# EAGLE schematic mic (EAGLE 6.1)

## Sheet 1 of 3
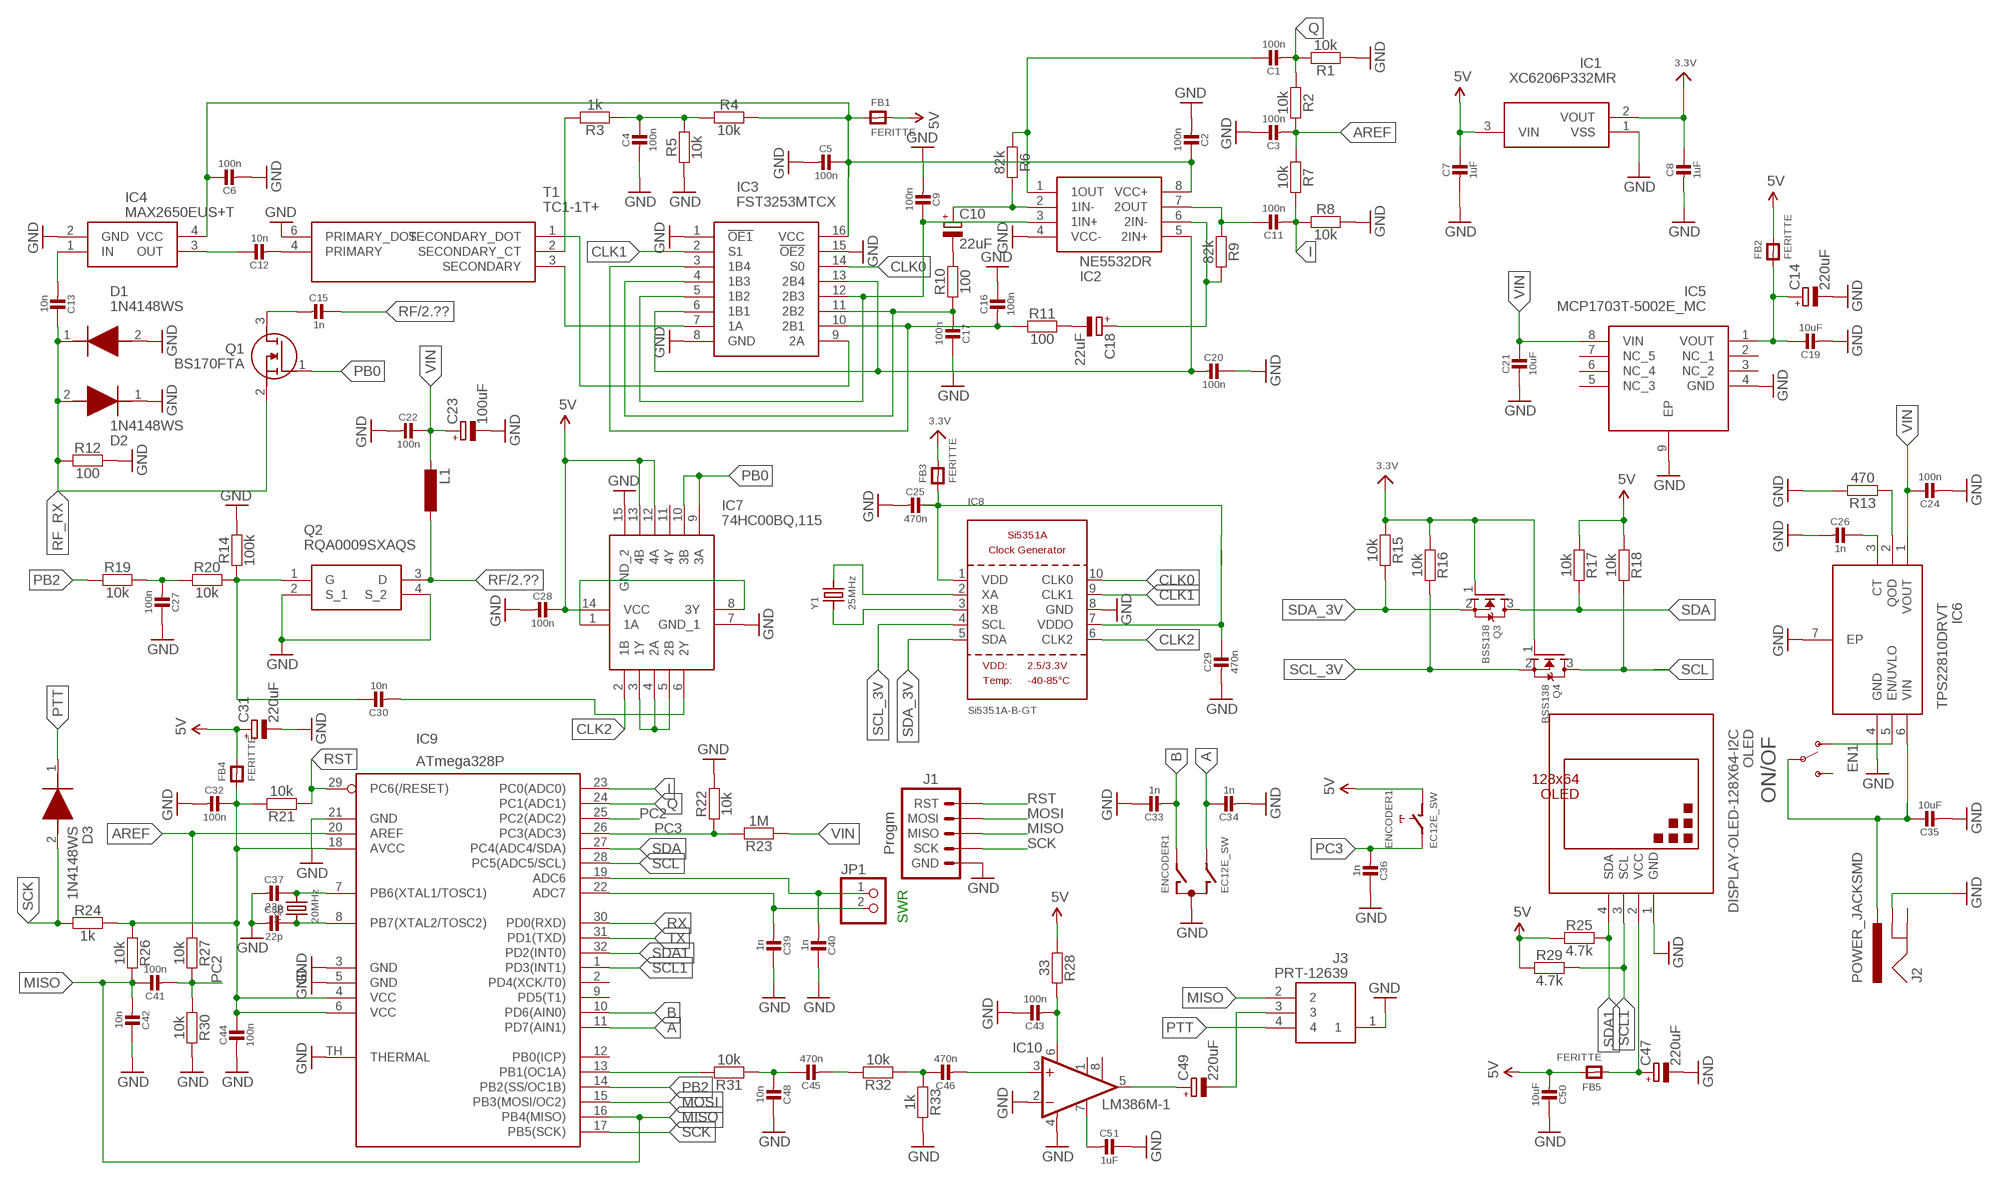
[diagram p0: schematic, sheet 1]

### Parts
C1  100n  CAP_CERAMIC_0402  [_0402]
C2  100n  CAP_CERAMIC_0402  [_0402]
C3  100n  CAP_CERAMIC_0402  [_0402]
C4  100n  CAP_CERAMIC_0402  [_0402]
C5  100n  CAP_CERAMIC_0402  [_0402]
C6  100n  CAP_CERAMIC_0402  [_0402]
C7  1uF  CAP_CERAMIC_0603  [_0603]
C8  1uF  CAP_CERAMIC_0603  [_0603]
C9  100n  CAP_CERAMIC_0402  [_0402]
C10  22uF  CPOL-EUSMCA  [SMC_A]
C11  100n  CAP_CERAMIC_0402  [_0402]
C12  10n  CAP_CERAMIC_0402  [_0402]
C13  10n  CAP_CERAMIC_0402  [_0402]
C14  220uF  CPOL-EUSANYO_A  [SANYO-OSCON_A]
C15  1n  CAP_CERAMIC_0603  [_0603]
C16  100n  CAP_CERAMIC_0402  [_0402]
C17  100n  CAP_CERAMIC_0402  [_0402]
C18  22uF  CPOL-EUSMCA  [SMC_A]
C19  10uF  CAP_CERAMIC_0402  [_0402]
C20  100n  CAP_CERAMIC_0402  [_0402]
C21  10uF  CAP_CERAMIC_0402  [_0402]
C22  100n  CAP_CERAMIC_0402  [_0402]
C23  100uF  CPOL-EUSMCD  [SMC_D]
C24  100n  CAP_CERAMIC_0805  [_0805]
C25  470n  CAP_CERAMIC_0402  [_0402]
C26  1n  CAP_CERAMIC_0402  [_0402]
C27  100n  CAP_CERAMIC_0402  [_0402]
C28  100n  CAP_CERAMIC_0402  [_0402]
C29  470n  CAP_CERAMIC_0402  [_0402]
C30  10n  CAP_CERAMIC_0402  [_0402]
C31  220uF  CPOL-EUSANYO_A  [SANYO-OSCON_A]
C32  100n  CAP_CERAMIC_0402  [_0402]
C33  1n  CAP_CERAMIC_0402  [_0402]
C34  1n  CAP_CERAMIC_0402  [_0402]
C35  10uF  CAP_CERAMIC_0805  [_0805]
C36  1n  CAP_CERAMIC_0402  [_0402]
C37  22p  CAP_CERAMIC_0402  [_0402]
C38  22p  CAP_CERAMIC_0402  [_0402]
C39  1n  CAP_CERAMIC_0402  [_0402]
C40  1n  CAP_CERAMIC_0402  [_0402]
C41  100n  CAP_CERAMIC_0402  [_0402]
C42  10n  CAP_CERAMIC_0402  [_0402]
C43  100n  CAP_CERAMIC_0402  [_0402]
C44  100n  CAP_CERAMIC_0402  [_0402]
C45  470n  CAP_CERAMIC_0402  [_0402]
C46  470n  CAP_CERAMIC_0402  [_0402]
C47  220uF  CPOL-EUSANYO_A  [SANYO-OSCON_A]
C48  10n  CAP_CERAMIC_0402  [_0402]
C49  220uF  CPOL-EUSANYO_A  [SANYO-OSCON_A]
C50  10uF  CAP_CERAMIC_0402  [_0402]
C51  1uF  CAP_CERAMIC_0402  [_0402]
D1  1N4148WS  [SODFL2512X90N]
D2  1N4148WS  [SODFL2512X90N]
D3  1N4148WS  [SODFL2512X90N]
ENCODER1  EC12E_SW  [ALPS_EC12E_SW]
FB1  FERITTE  FERRITE_0603  [_0603]
FB2  FERITTE  FERRITE_0603  [_0603]
FB3  FERITTE  FERRITE_0603  [_0603]
FB4  FERITTE  FERRITE_0603  [_0603]
FB5  FERITTE  FERRITE_0603  [_0603]
IC1  XC6206P332MR  [SOT95P280X130-3N]
IC2  NE5532DR  [SOIC127P600X175-8N]
IC3  FST3253MTCX  [SOP65P640X110-16N]
IC4  MAX2650EUS+T  [4-SOT143]
IC5  MCP1703T-5002E_MC  [SON50P300X200X100-9N]
IC6  TPS22810DRVT  [SON65P200X200X80-7N]
IC7  74HC00BQ,115  [74HC00BQ115]
IC8  Si5351A-B-GT  SI5351A  [MSOP10]
IC9  ATmega328P  MEGA8-MI  [MLF32-TH]
IC10  LM386M-1  [SO08]
J1  Progm  SPARKFUN-CONNECTORS_PIC-ICSP-MINI  [SPARKFUN-CONNECTORS_PIC-ICSP-MINI]
J2  POWER_JACKSMD  [POWER_JACK_SMD]
J3  PRT-12639  [PRT12639]
JP1  PINHD-1X2  [1X02]
L1  RCL_L-EUTFI0305  [RCL_TFI0305]
OLED  DISPLAY-OLED-128X64-I2C  NEW_DIY-MODULES_(1)_DISPLAY-OLED-128X64-I2C  [NEW_DIY-MODULES_(1)_DISPLAY-OLED-128X64-I2C]
ON/OF  SWITCH-SPDT-SMD-RIGHT-ANGLE  [SWITCH_SPST_SMD_A]
Q1  BS170FTA  [SOT96P240X100-3N]
Q2  RQA0009SXAQS  [RQA0009SXAQS]
Q3  BSS138  MOSFET-NWIDE  [SOT23-WIDE]
Q4  BSS138  MOSFET-NWIDE  [SOT23-WIDE]
R1  10k  RESISTORS-0402  [C0402]
R2  10k  RESISTORS-0402  [C0402]
R3  1k  RESISTORS-0402  [C0402]
R4  10k  RESISTORS-0402  [C0402]
R5  10k  RESISTORS-0402  [C0402]
R6  82k  RESISTORS-0402  [C0402]
R7  10k  RESISTORS-0402  [C0402]
R8  10k  RESISTORS-0402  [C0402]
R9  82k  RESISTORS-0402  [C0402]
R10  100  RESISTORS-0402  [C0402]
R11  100  RESISTORS-0402  [C0402]
R12  100  RESISTORS-0603  [C0603]
R13  470  RESISTORS-0402  [C0402]
R14  100k  RESISTORS-0402  [C0402]
R15  10k  RESISTORS-0402  [C0402]
R16  10k  RESISTORS-0402  [C0402]
R17  10k  RESISTORS-0402  [C0402]
R18  10k  RESISTORS-0402  [C0402]
R19  10k  RESISTORS-0402  [C0402]
R20  10k  RESISTORS-0402  [C0402]
R21  10k  RESISTORS-0402  [C0402]
R22  10k  RESISTORS-0402  [C0402]
R23  1M  RESISTORS-0402  [C0402]
R24  1k  RESISTORS-0402  [C0402]
R25  4.7k  RESISTORS-0402  [C0402]
R26  10k  RESISTORS-0402  [C0402]
R27  10k  RESISTORS-0402  [C0402]
R28  33  RESISTORS-0805  [C0805]
R29  4.7k  RESISTORS-0402  [C0402]
R30  10k  RESISTORS-0402  [C0402]
R31  10k  RESISTORS-0402  [C0402]
R32  10k  RESISTORS-0402  [C0402]
R33  1k  RESISTORS-0402  [C0402]
T1  TC1-1T+  [TC11T]
Y1  25MHz  CRYSTAL3.2X2.5  [CRYSTAL_3.2X2.5]
Y2  20MHz  CRYSTAL3.2X2.5  [CRYSTAL_3.2X2.5]

### Nets
5V: C7.1 C28.1 C31.+ C50.2 ENCODER1.D FB1.2 FB2.2 FB4.2 FB5.2 IC1.3(VIN) IC7.12(4A) IC7.13(4B) IC7.14(VCC) R17.2 R18.2 R25.2 R28.2 R29.2 ; also sheet 2
A: C34.1 ENCODER1.B IC9.11(PD7(AIN1))
AREF: C3.2 IC9.20(AREF) R2.1 R7.2 R27.2
B: C33.2 ENCODER1.A IC9.10(PD6(AIN0))
CLK0: IC3.14(S0) IC8.10(CLK0)
CLK1: IC3.2(S1) IC8.9(CLK1)
CLK2: IC7.2(1B) IC8.6(CLK2)
EN1: IC6.5(EN/UVLO) ON/OF.1(O)
GND: C2.2 C3.1 C4.2 C5.2 C6.2 C7.2 C8.2 C9.2 C14.- C16.1 C17.1 C19.2 C20.1 C21.2 C22.2 C23.- C24.2 C25.2 C26.2 C27.1 C28.2 C29.2 C31.- C32.2 C33.1 C34.2 C35.2 C36.1 C37.2 C38.2 C39.1 C40.1 C42.1 C43.1 C44.2 C47.- C48.1 C50.1 C51.1 D1.2(A) D2.1(K) ENCODER1.C IC1.1(VSS) IC2.4(VCC-) IC3.1(!OE1) IC3.8(GND) IC3.15(!OE2) IC4.2(GND) IC5.4(GND) IC5.9(EP) IC6.4(GND) IC6.7(EP) IC7.7(GND_1) IC7.15(GND_2) IC8.8(GND) IC9.3(GND) IC9.5(GND) IC9.21(GND) IC9.TH(THERMAL) IC10.2(-IN) IC10.4(GND) J1.5(GND) J2.GND(GNDBREAK) J3.1 OLED.1(GND) Q2.2(S_1) Q2.4(S_2) R1.2 R5.2 R8.1 R12.1 R13.2 R14.1 R22.1 R30.1 R33.1 T1.6(PRIMARY_DOT) ; also sheet 2,3
I: C11.2 IC9.23(PC0(ADC0)) R7.1 R8.2
MISO: C41.1 C42.2 IC9.16(PB4(MISO)) J1.3(MISO) J3.2 R26.1
MOSI: IC9.15(PB3(MOSI/OC2)) J1.2(MOSI)
N$1: IC7.3(1Y) IC7.4(2A) IC7.5(2B)
N$6: IC3.7(1A) T1.3(SECONDARY)
N$12: C47.+ FB5.1 OLED.2(VCC)
N$13: C37.1 IC9.7(PB6(XTAL1/TOSC1)) Y2.2
N$14: C38.1 IC9.8(PB7(XTAL2/TOSC2)) Y2.1
N$16: IC3.9(2A) T1.1(SECONDARY_DOT)
N$22: C4.1 R3.2 R4.2 R5.1
N$23: IC7.1(1A) IC7.8(3Y)
N$24: C30.2 IC7.6(2Y)
N$25: C30.1 Q2.1(G) R14.2 R20.1
N$26: C27.2 R19.1 R20.2
N$27: C26.1 IC6.3(CT)
N$28: C20.2 IC2.5(2IN+) IC3.6(1B1) IC3.13(2B4)
N$29: C9.1 IC2.3(1IN+) IC3.5(1B2) IC3.12(2B3)
N$30: R3.1 T1.2(SECONDARY_CT)
N$31: C17.2 IC3.4(1B3) IC3.11(2B2) R10.2
N$32: C16.2 IC3.3(1B4) IC3.10(2B1) R11.2
N$33: C1.1 IC2.1(1OUT) R6.2
N$34: IC9.13(PB1(OC1A)) R31.1
N$35: C45.1 C48.2 R31.2
N$36: C11.1 IC2.7(2OUT) R9.2
N$37: C18.- R11.1
N$38: C18.+ IC2.6(2IN-) R9.1
N$39: C10.+ IC2.2(1IN-) R6.1
N$40: C10.- R10.1
N$41: C45.2 R32.1
N$43: C46.1 R32.2 R33.2
N$44: C32.1 C44.1 FB4.1 IC9.4(VCC) IC9.6(VCC) IC9.18(AVCC) R21.1 R24.1 R26.2
N$45: C46.2 IC10.3(+IN)
N$46: C43.2 IC10.6(VS) R28.1
N$47: C51.2 IC10.7(BYPASS)
N$48: C49.+ IC10.5(OUT)
N$49: C49.- J3.3
N$50: C12.2 T1.4(PRIMARY)
N$51: C12.1 IC4.3(OUT)
N$52: C13.2 IC4.1(IN)
N$53: C15.2 Q1.3(D)
N$54: C14.+ C19.1 FB2.1 IC5.1(VOUT)
N$55: C2.1 C5.1 C6.1 FB1.1 IC2.8(VCC+) IC3.16(VCC) IC4.4(VCC) R4.1
N$56: IC8.3(XB) Y1.1
N$57: IC8.2(XA) Y1.2
N$58: IC6.2(QOD) R13.1
N$59: C25.1 C29.1 FB3.1 IC8.1(VDD) IC8.7(VDDO)
N$60: C40.2 IC9.19(ADC6) JP1.1
N$61: C39.2 IC9.22(ADC7) JP1.2
PB0: IC7.9(3A) IC7.10(3B) Q1.1(G)
PB2: IC9.14(PB2(SS/OC1B)) R19.2
PC2: C41.2 IC9.25(PC2(ADC2)) R27.1 R30.2
PC3: C36.2 ENCODER1.E IC9.26(PC3(ADC3)) R22.2 R23.1
PTT: D3.1(K) J3.4
Q: C1.2 IC9.24(PC1(ADC1)) R1.1 R2.2
RF: C15.1 L1.1 Q2.3(D) ; also sheet 2
RF_RX: C13.1 D1.1(K) D2.2(A) Q1.2(S) R12.2
RST: IC9.29(PC6(/RESET)) J1.1(RST) R21.2
RX: IC9.30(PD0(RXD)) ; also sheet 3
SCK: D3.2(A) IC9.17(PB5(SCK)) J1.4(SCK) R24.2
SCL: IC9.28(PC5(ADC5/SCL)) Q4.3(D) R18.1 ; also sheet 2
SCL1: IC9.1(PD3(INT1)) OLED.3(SCL) R29.1
SCL_3V: IC8.4(SCL) Q4.2(S) R16.1
SDA: IC9.27(PC4(ADC4/SDA)) Q3.3(D) R17.1 ; also sheet 2
SDA1: IC9.32(PD2(INT0)) OLED.4(SDA) R25.1
SDA_3V: IC8.5(SDA) Q3.2(S) R15.1
TX: IC9.31(PD1(TXD)) ; also sheet 3
VDD: C8.1 FB3.2 IC1.2(VOUT) Q3.1(G) Q4.1(G) R15.2 R16.2 ; supply symbol labelled 3.3V
VIN: C21.1 C22.1 C23.+ C24.1 IC5.8(VIN) IC6.1(VOUT) L1.2 R23.2
VIN1: C35.1 IC6.6(VIN) J2.VIN0(PWR) ON/OF.2(P)
Unconnected: ENCODER1.GND1(G) ENCODER1.GND2(G) IC5.2(NC_1) IC5.3(NC_2) IC5.5(NC_3) IC5.6(NC_4) IC5.7(NC_5) IC7.11(4Y) IC9.2(PD4(XCK/T0)) IC9.9(PD5(T1)) IC9.12(PB0(ICP)) IC10.1(GAIN) IC10.8(GAIN) J2.P$4(GND) ON/OF.3(S)

### Notes on the sheet
- SWR

## Sheet 2 of 3
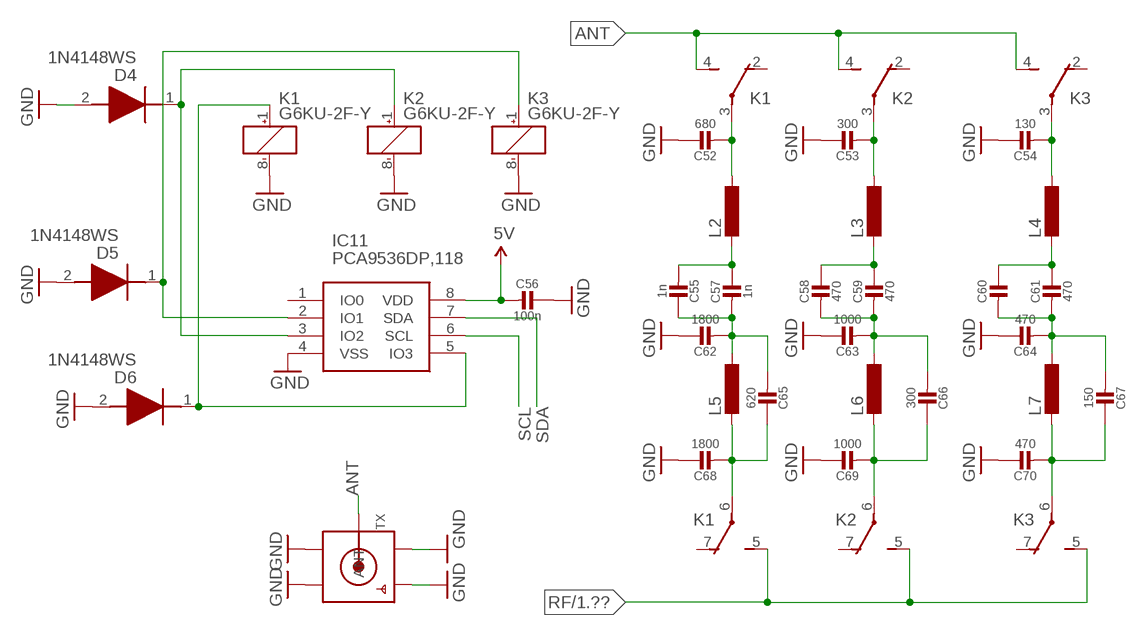
[diagram p1: schematic, sheet 2]

### Parts
C52  680  CAP_CERAMIC_0603  [_0603]
C53  300  CAP_CERAMIC_0603  [_0603]
C54  130  CAP_CERAMIC_0603  [_0603]
C55  1n  CAP_CERAMIC_0603  [_0603]
C56  100n  CAP_CERAMIC_0402  [_0402]
C57  1n  CAP_CERAMIC_0603  [_0603]
C58  470  CAP_CERAMIC_0603  [_0603]
C59  470  CAP_CERAMIC_0603  [_0603]
C60  CAP_CERAMIC_0603  [_0603]
C61  470  CAP_CERAMIC_0603  [_0603]
C62  1800  CAP_CERAMIC_0603  [_0603]
C63  1000  CAP_CERAMIC_0603  [_0603]
C64  470  CAP_CERAMIC_0603  [_0603]
C65  620  CAP_CERAMIC_0603  [_0603]
C66  300  CAP_CERAMIC_0603  [_0603]
C67  150  CAP_CERAMIC_0603  [_0603]
C68  1800  CAP_CERAMIC_0603  [_0603]
C69  1000  CAP_CERAMIC_0603  [_0603]
C70  470  CAP_CERAMIC_0603  [_0603]
D4  1N4148WS  [SODFL2512X90N]
D5  1N4148WS  [SODFL2512X90N]
D6  1N4148WS  [SODFL2512X90N]
IC11  PCA9536DP,118  [SOP65P490X110-8N]
K1  G6KU-2F-Y  [G6KU-2F-Y]
K2  G6KU-2F-Y  [G6KU-2F-Y]
K3  G6KU-2F-Y  [G6KU-2F-Y]
L2  RCL_L-EUTFI0305  [RCL_TFI0305]
L3  RCL_L-EUTFI0305  [RCL_TFI0305]
L4  RCL_L-EUTFI0305  [RCL_TFI0305]
L5  RCL_L-EUTFI0305  [RCL_TFI0305]
L6  RCL_L-EUTFI0305  [RCL_TFI0305]
L7  RCL_L-EUTFI0305  [RCL_TFI0305]
TX  MODULATOR_MICROBUILDER_SMACONNECTOR_EDGE_UFL  [MODULATOR_MICROBUILDER_SMA_EDGELAUNCH_UFL]

### Nets
5V: C56.2 IC11.8(VDD) ; also sheet 1
ANT: K1.4(2:S) K2.4(2:S) K3.4(2:S) TX.P(ANT)
GND: C52.1 C53.1 C54.1 C56.1 C62.1 C63.1 C64.1 C68.1 C69.1 C70.1 D4.2(A) D5.2(A) D6.2(A) IC11.4(VSS) K1.8(1:-) K2.8(1:-) K3.8(1:-) TX.GND@1(GND1) TX.GND@2(GND2) TX.GND@3(GND3) TX.GND@4(GND4) ; also sheet 1,3
N$2: C55.2 C57.1 L2.2
N$3: C55.1 C57.2 C62.2 C65.2 L5.1
N$4: C58.1 C59.1 L3.2
N$5: C52.2 K1.3(2:P) L2.1
N$7: C53.2 K2.3(2:P) L3.1
N$8: C54.2 K3.3(2:P) L4.1
N$9: C67.1 C70.2 K3.6(3:P) L7.2
N$10: C66.1 C69.2 K2.6(3:P) L6.2
N$11: C65.1 C68.2 K1.6(3:P) L5.2
N$15: C58.2 C59.2 C63.2 C66.2 L6.1
N$17: C60.2 C61.2 C64.2 C67.2 L7.1
N$18: C60.1 C61.1 L4.2
N$19: D6.1(K) IC11.5(IO3) K1.1(1:+)
N$20: D4.1(K) IC11.3(IO2) K2.1(1:+)
N$21: D5.1(K) IC11.2(IO1) K3.1(1:+)
RF: K1.5(3:S) K2.5(3:S) K3.5(3:S) ; also sheet 1
SCL: IC11.6(SCL) ; also sheet 1
SDA: IC11.7(SDA) ; also sheet 1
Unconnected: IC11.1(IO0) K1.2(2:O) K1.7(3:O) K2.2(2:O) K2.7(3:O) K3.2(2:O) K3.7(3:O)

## Sheet 3 of 3
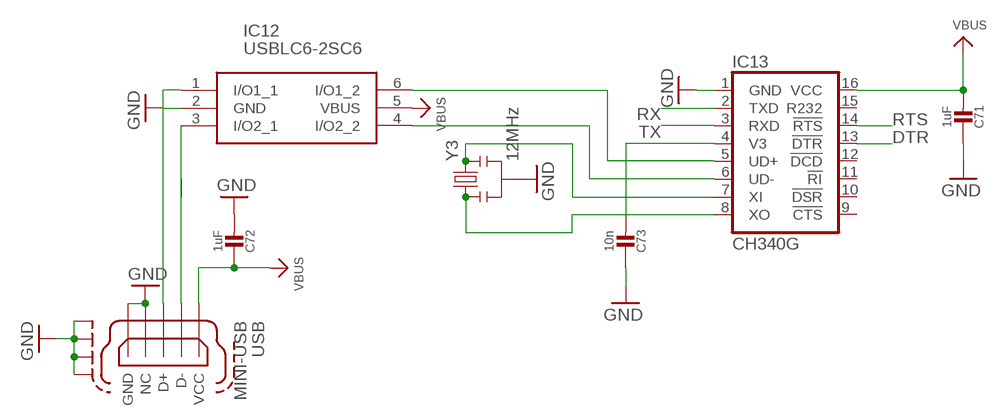
[diagram p2: schematic, sheet 3]

### Parts
C71  1uF  CAP_CERAMIC_0603  [_0603]
C72  1uF  CAP_CERAMIC_0603  [_0603]
C73  10n  CAP_CERAMIC_0603  [_0603]
IC12  USBLC6-2SC6  [SOT95P280X145-6N]
IC13  CH340G  CH340GSMD  [SO016]
USB  MINI-USB  [MINI-USB-B5]
Y3  12MHz  RESONATORSMD  [RESONATOR-SMD]

### Nets
DTR: IC13.13(!DTR)
GND: C71.1 C72.2 C73.1 IC12.2(GND) IC13.1(GND) USB.4(NC) USB.5(GND) USB.M1(S1) USB.M2(S2) USB.M3(S3) USB.M4(S4) Y3.2 ; also sheet 1,2
N$62: IC12.6(I/O1_2) IC13.5(UD+)
N$63: IC12.4(I/O2_2) IC13.6(UD-)
N$64: IC13.8(XO) Y3.1
N$65: IC13.7(XI) Y3.3
N$67 [USB]: IC12.1(I/O1_1) USB.3(D+)
N$79: IC12.3(I/O2_1) USB.2(D-)
RTS: IC13.14(!RTS)
RX: IC13.2(TXD) ; also sheet 1
TX: IC13.3(RXD) ; also sheet 1
V3: C73.2 IC13.4(V3)
VBUS: C71.2 C72.1 IC12.5(VBUS) IC13.16(VCC) USB.1(VCC)
Unconnected: IC13.9(!CTS) IC13.10(!DSR) IC13.11(!RI) IC13.12(!DCD) IC13.15(R232)

## Library data of the parts
C1-C9 C11-C13 C15-C17 C19-C22 C24-C30 C32-C46 C48 C50-C73 = microbuilder:CAP_CERAMIC: Ceramic Capacitors For new designs, use the packages preceded by an '_' character since they are more reliable: The following footprints should be used on most boards: _0402 - Standard footprint for regular board layouts _0603 - Standard footprint for regular board layouts _0805 - Standard footprint for regular board layouts _1206 - Standard footprint for regular board layouts For extremely tight-pitch boards where space is at a premium, the following 'micro-pitch' footprints can be used (smaller pads, no silkscreen outline, etc.): _0402MP - Micro-pitch footprint for very dense/compact boards _0603MP - Micro-pitch footprint for very dense/compact boards _0805MP - Micro-pitch footprint for very dense/compact boards _1206MP - Micro-pitch footprint for very dense/compact boards
C10 C14 C18 C23 C31 C47 C49 = rcl:CPOL-EU: POLARIZED CAPACITOR, European symbol
D1-D6 = 1N4148WS:1N4148WS: ON Semiconductor Switching Diode, 300mA 75V, 2-Pin SOD-323 1N4148WS Source: Datasheet; ARROW_PART_NUMBER: 1N4148WS; ARROW_PRICE-STOCK: https://www.arrow.com/en/products/1n4148ws/on-semiconductor?region=europe; DESCRIPTION: ON Semiconductor Switching Diode, 300mA 75V, 2-Pin SOD-323 1N4148WS; HEIGHT: 0.9mm; MANUFACTURER_NAME: onsemi; MANUFACTURER_PART_NUMBER: 1N4148WS; MOUSER_PART_NUMBER: 512-1N4148WS; MOUSER_PRICE-STOCK: https://www.mouser.co.uk/ProductDetail/onsemi-Fairchild/1N4148WS?qs=2%2FYqgE%252BHg%252BKBrKZlAsMLhw%3D%3D
ENCODER1 = switch-alps:EC12E_SW: ALPS rotary Encoder EC12E series with switch; MPN: EC12E2424407; OC_FARNELL: 1520813; OC_NEWARK: 74M1068
FB1-FB5 = microbuilder:FERRITE: Ferrite Bead 0603 MMZ1608B121C - 120 Ohm @ 100MHz, 600mA, 0.15 Ohm DC Resistance - Digikey: 445-2164-1-ND BK1608HW121-T - 120 Ohm, 600mA Ferrite Chip - Digikey: 587-1876-2-ND 0805 HZ0805B272R-10 - 2.7K Ohm @ 100MHz, 200mA, 0.8 Ohm DC Resistance - Digikey: 240-2504-1-ND (see also Murata BLM21BD272SN1L) MMZ2012Y152B - 1.5K Ohm @ 100MHz, 500mA, 0.4 Ohm DC Resistance - Digikey: 445-1560-1-ND - Mainly for high frequency (80-400MHz) MMZ2012R102A - 1K Ohm @ 100MHz, 500mA, 0.3 Ohm DC Resistance - Digikey: 445-1555-2-ND - More general purpose (10-200MHz)
IC1 = SamacSys_Parts:XC6206P332MR: Low ESR Cap.Compatible Postive Voltage Regulators Source: Datasheet <http://www.torexsemi.com/products/voltage_regulators/data/XC6206.pdf>; ARROW_PART_NUMBER: XC6206P332MR; DESCRIPTION: Low ESR Cap.Compatible Postive Voltage Regulators; HEIGHT: 1.3mm; MANUFACTURER_NAME: Torex; MANUFACTURER_PART_NUMBER: XC6206P332MR
IC2 = NE5532DR:NE5532DR: NE5532DR, Dual Operational Amplifier 10MHz, 8-Pin SOIC Source: Datasheet <http://www.ti.com/lit/ds/symlink/ne5532.pdf>; ARROW_PART_NUMBER: NE5532DR; ARROW_PRICE-STOCK: https://www.arrow.com/en/products/ne5532dr/texas-instruments?region=nac; DESCRIPTION: NE5532DR, Dual Operational Amplifier 10MHz, 8-Pin SOIC; HEIGHT: 1.75mm; MANUFACTURER_NAME: Texas Instruments; MANUFACTURER_PART_NUMBER: NE5532DR; MOUSER_PART_NUMBER: 595-NE5532DR; MOUSER_PRICE-STOCK: https://www.mouser.co.uk/ProductDetail/Texas-Instruments/NE5532DR?qs=LzFo6vGRJ4tu9UjwVgwNUQ%3D%3D
IC3 = FST3253MTCX:FST3253MTCX: IC, Fairchild, FST3253MTCX Fairchild Semiconductor FST3253MTCX, Multiplexer/Demultiplexer Dual 4:1 Multiplexer, 4 5.5 V, 16-Pin TSSOP Source: Datasheet <https://componentsearchengine.com/Datasheets/2/FST3253MTCX.pdf>; ARROW_PART_NUMBER: FST3253MTCX; ARROW_PRICE-STOCK: https://www.arrow.com/en/products/fst3253mtcx/on-semiconductor?region=nac; DESCRIPTION: IC, Fairchild, FST3253MTCX Fairchild Semiconductor FST3253MTCX, Multiplexer/Demultiplexer Dual 4:1 Multiplexer, 4 5.5 V, 16-Pin TSSOP; HEIGHT: 1.1mm; MANUFACTURER_NAME: onsemi; MANUFACTURER_PART_NUMBER: FST3253MTCX; MOUSER_PART_NUMBER: 512-FST3253MTCX; MOUSER_PRICE-STOCK: https://www.mouser.co.uk/ProductDetail/ON-Semiconductor-Fairchild/FST3253MTCX?qs=9%2FFjV4%2Fi8eqnAjRVZNaJgw%3D%3D
IC4 = MAX2650EUS+T:MAX2650EUS+T: MAXIM INTEGRATED PRODUCTS - MAX2650EUS+T - RF AMP, DC-1GHZ, 18.3DB, SOT-143-4 Source: Datasheet <https://componentsearchengine.com/Datasheets/2/MAX2650EUS T.pdf>; DESCRIPTION: MAXIM INTEGRATED PRODUCTS - MAX2650EUS+T - RF AMP, DC-1GHZ, 18.3DB, SOT-143-4; HEIGHT: mm; MANUFACTURER_NAME: Maxim Integrated; MANUFACTURER_PART_NUMBER: MAX2650EUS+T; MOUSER_PART_NUMBER: 700-MAX2650EUS+T; MOUSER_PRICE-STOCK: https://www.mouser.com/Search/Refine.aspx?Keyword=700-MAX2650EUS%2BT
IC5 = MCP1703T-5002E_MC:MCP1703T-5002E_MC: LDO Voltage Regulators Low Iq 250mA LDO Vin 16V Vout=1.2V Source: Datasheet <http://ww1.microchip.com/downloads/en/DeviceDoc/22049f.pdf>; ARROW_PART_NUMBER: MCP1703T-5002E/MC; ARROW_PRICE-STOCK: https://www.arrow.com/en/products/mcp1703t-5002emc/microchip-technology?region=nac; DESCRIPTION: LDO Voltage Regulators Low Iq 250mA LDO Vin 16V Vout=1.2V; HEIGHT: 1mm; MANUFACTURER_NAME: Microchip; MANUFACTURER_PART_NUMBER: MCP1703T-5002E/MC; MOUSER_PART_NUMBER: 579-MCP1703T5002E/MC; MOUSER_PRICE-STOCK: https://www.mouser.co.uk/ProductDetail/Microchip-Technology/MCP1703T-5002E-MC?qs=kI7nsUnms467toqLH7A5CQ%3D%3D
IC6 = TPS22810DRVT:TPS22810DRVT: 18V, 3A, 79m load switch with adjustable rise time, adj. quick output discharge, & thermal shutdown Source: Datasheet <http://www.ti.com/general/docs/lit/getliterature.tsp?genericPartNumber=TPS22810&fileType=pdf>; ARROW_PART_NUMBER: TPS22810DRVT; ARROW_PRICE-STOCK: https://www.arrow.com/en/products/tps22810drvt/texas-instruments?region=nac; DESCRIPTION: 18V, 3A, 79m load switch with adjustable rise time, adj. quick output discharge, & thermal shutdown; HEIGHT: 0.8mm; MANUFACTURER_NAME: Texas Instruments; MANUFACTURER_PART_NUMBER: TPS22810DRVT; MOUSER_PART_NUMBER: 595-TPS22810DRVT; MOUSER_PRICE-STOCK: https://www.mouser.co.uk/ProductDetail/Texas-Instruments/TPS22810DRVT?qs=5aG0NVq1C4wtEcND0E9Qlg%3D%3D
IC7 = 74HC00BQ_115:74HC00BQ,115: 74HC(T)00 - Quad 2-input NAND gate@en-us Source: Datasheet <https://assets.nexperia.com/documents/data-sheet/74HC_HCT00.pdf>; ARROW_PART_NUMBER: 74HC00BQ,115; ARROW_PRICE-STOCK: https://www.arrow.com/en/products/74hc00bq115/nexperia?region=nac; DESCRIPTION: 74HC(T)00 - Quad 2-input NAND gate@en-us; HEIGHT: 1mm; MANUFACTURER_NAME: Nexperia; MANUFACTURER_PART_NUMBER: 74HC00BQ,115; MOUSER_PART_NUMBER: 771-74HC00BQ-G; MOUSER_PRICE-STOCK: https://www.mouser.co.uk/ProductDetail/Nexperia/74HC00BQ115?qs=P62ublwmbi8kvvXBT31ARA%3D%3D
IC8 = microbuilder:SI5351A: Si5351A 8kHz-160MHz I2C Clock Generator VDD: 2.5V or 3.3V Input Range: 25MHz or 27MHz XTAL User selectable internal input load capacitors: 6, 8 or 10 pF Output Impedance: 85 Ohm Output Load Capacitance: 5-15pF Operating Temperature: -40°C - 85°C Operating Current (3 outputs): 35mA Output buffer voltage (VDDO): 1.8, 2.5 or 3.3V Note: If VDDO is not used it should be connected to VDD. Unused clock out pins should be left floating.
IC9 = microbuilder:MEGA8-MI: MICROCONTROLLER 8 Kbytes FLASH, 1 kbytes SRAM, 512 bytes EEPROM, USART, 6-channel 10 bit ADC, 2-channel 8 bit ADC Pin compatible with Atmega48, ATMega88, ATMega168 Source: avr.lbr; MPN: ATMEGA88PA-MU; OC_FARNELL: 1715491; OC_NEWARK: 15R0272
IC10 = linear:LM386?-*: Low Voltage Audio Power Amplifier Source: http://cache.national.com/ds/LM/LM386.pdf
IC11 = PCA9536DP_118:PCA9536DP,118: 4-bit I2C-bus and SMBus I/O port Source: Datasheet <http://www.nxp.com/docs/en/data-sheet/PCA9536.pdf>; ARROW_PART_NUMBER: PCA9536DP,118; ARROW_PRICE-STOCK: https://www.arrow.com/en/products/pca9536dp118/nxp-semiconductors?region=nac; DESCRIPTION: 4-bit I2C-bus and SMBus I/O port; HEIGHT: 1.1mm; MANUFACTURER_NAME: NXP; MANUFACTURER_PART_NUMBER: PCA9536DP,118; MOUSER_PART_NUMBER: 771-PCA9536DP-T; MOUSER_PRICE-STOCK: https://www.mouser.co.uk/ProductDetail/NXP-Semiconductors/PCA9536DP118?qs=LOCUfHb8d9ubAwWIgMOyZQ%3D%3D
IC12 = SamacSys_Parts:USBLC6-2SC6: TVS Diode Array Uni-Directional USBLC6-2SC6 17V, SOT-23 6-Pin Source: Datasheet <http://www.st.com/st-web-ui/static/active/en/resource/technical/document/datasheet/CD00050750.pdf>; ARROW_PART_NUMBER: USBLC6-2SC6; ARROW_PRICE-STOCK: https://www.arrow.com/en/products/usblc6-2sc6/stmicroelectronics; DESCRIPTION: TVS Diode Array Uni-Directional USBLC6-2SC6 17V, SOT-23 6-Pin; HEIGHT: 1.45mm; MANUFACTURER_NAME: STMicroelectronics; MANUFACTURER_PART_NUMBER: USBLC6-2SC6; MOUSER_PART_NUMBER: 511-USBLC6-2SC6; MOUSER_PRICE-STOCK: https://www.mouser.co.uk/ProductDetail/STMicroelectronics/USBLC6-2SC6/?qs=po45yt2pPpu%2FhNIlwQdTlg%3D%3D
IC13 = SparkFun-DigitalIC:CH340G: A simple USB 2.0 to Serial IC.; PROD_ID: IC-13498
J1 = snaige:SPARKFUN-CONNECTORS_PIC-ICSP-MINI: PIC-ICSP-Mini Miniature 5-pin connection for temporary programming of PICs. Use this device in your design to save space. Program the PIC with this adapter Spark Fun Electronics SKU : BOB-00194
J2 = SparkFun-Connectors:POWER_JACK: Power Jack This is the standard 5.5mm barrel jack for power. The PTH is the most common, proven, reliable, footprint. The Slot footprint only works if the mill layer is transmitted to the PCB fab house so be warned. Mating wall wart : TOL-00298 (and others); PROD_ID: CONN-08106; SF_ID: PRT-12748; VALUE: 5.5x2.1mm Barrel
J3 = PRT-12639:PRT-12639: SparkFun Accessories Audio Jack - 3.5mm TRRS (SMD) Source: Datasheet <http://cdn.sparkfun.com/datasheets/Prototyping/20153.pdf>; ARROW_PART_NUMBER: PRT-12639; ARROW_PRICE-STOCK: https://www.arrow.com/en/products/prt-12639/sparkfun-electronics?region=nac; DESCRIPTION: SparkFun Accessories Audio Jack - 3.5mm TRRS (SMD); HEIGHT: 5.3mm; MANUFACTURER_NAME: SparkFun; MANUFACTURER_PART_NUMBER: PRT-12639; MOUSER_PART_NUMBER: 474-PRT-12639; MOUSER_PRICE-STOCK: https://www.mouser.co.uk/ProductDetail/SparkFun/PRT-12639?qs=WyAARYrbSnautCwYhJcFjA%3D%3D
JP1 = pinhead:PINHD-1X2: PIN HEADER
K1-K3 = relay:G6K: Low Signal Relay oeiwcsnts1.omron.com/.. D20G6K0100.pdf; MF: OMRON COMPONENTS USA; MPN: G6KU-2F-Y DC3; OC_FARNELL: unknown; OC_NEWARK: 89C6496
L1-L7 = QCX1:RCL_L-EU: INDUCTOR, European symbol
OLED = mic:NEW_DIY-MODULES_(1)_DISPLAY-OLED-128X64-I2C: 128x64 Dot Matrix OLED Module based on SSD1306 chip Variant with I2C interface More details available here: http://www.instructables.com/id/Monochrome-096-i2c-OLED-display-with-arduino-SSD13/ SSD1306 datasheet: https://cdn-shop.adafruit.com/datasheets/SSD1306.pdf Click here to find device on ebay.com <http://www.ebay.com/sch/oled+display+128x64+iic> Note: There are two variants: I2C and SPI. Search for the proper version.
ON/OF = SparkFun-Switches:SWITCH-SPDT: Single Pole, Double Throw (SPDT) Switch Single-pole, double-throw (SPDT) switch. Variant Overview SMD-AYZ0202 Surface Mount DPDT Switch <https://www.sparkfun.com/products/597> (COM-00597) Used on e.g. LilyPad Arduino USB - ATmega32U4 Board <https://www.sparkfun.com/products/12049> PTH-11.6X4.0MM SPDT Mini Power Switch <https://www.sparkfun.com/products/102> (COM-00102) Used on e.g. SparkFun Simon Says - Through-Hole Soldering Kit <https://www.sparkfun.com/products/10547> (KIT-10547) PTH-11.6X4.0MM-KIT KIT version of SPDT Mini Power Switch - Simplifies soldering by removing tStop of switch pins - only one side can be soldered. PTH-11.6X4.0MM-LOCK LOCK version of SPDT Mini Power Switch - Offset pins hold switch in place for easier soldering. SMD-RIGHT-ANGLE Surface Mount Right Angle Switch <https://www.sparkfun.com/products/10860> (COM-10860) Used on e.g. SparkFun ESP8266 Thing <https://www.sparkfun.com/products/13231>; PROD_ID: SWCH-10651; SF_SKU: COM-10860
Q1 = SamacSys_Parts:BS170FTA: MOSFET N-Channel 60V 0.00015A SOT23 Diodes Inc BS170FTA N-channel MOSFET Transistor, 0.00015 A, 60 V, 3-Pin SOT-23 Source: Datasheet <http://uk.rs-online.com/webdocs/00af/0900766b800af6ad.pdf>; ALLIED_NUMBER: 70437742; ALLIED_PRICE-STOCK: https://www.alliedelec.com/diodes-inc-bs170fta/70437742/; DESCRIPTION: MOSFET N-Channel 60V 0.00015A SOT23 Diodes Inc BS170FTA N-channel MOSFET Transistor, 0.00015 A, 60 V, 3-Pin SOT-23; HEIGHT: 1mm; MANUFACTURER_NAME: Diodes Inc.; MANUFACTURER_PART_NUMBER: BS170FTA; MOUSER_PART_NUMBER: 522-BS170FTA; MOUSER_PRICE-STOCK: https://www.mouser.com/Search/Refine.aspx?Keyword=522-BS170FTA; RS_PART_NUMBER: 2156587P; RS_PRICE-STOCK: http://uk.rs-online.com/web/p/products/2156587P
Q2 = RQA0009SXAQS:RQA0009SXAQS: Silicon N-Channel MOS FET Source: Datasheet <https://datasheet.datasheetarchive.com/originals/distributors/Datasheets-26/DSA-515533.pdf>; DESCRIPTION: Silicon N-Channel MOS FET; HEIGHT: 1.6mm; MANUFACTURER_NAME: Renesas Electronics; MANUFACTURER_PART_NUMBER: RQA0009SXAQS
Q3 Q4 = microbuilder:MOSFET-N: N-Channel Mosfet LEGEND VDS: Voltage Drain-Source ID: Drain Current RDS(ON): Drain-Source On-State Resistance VGS(TH): Gate-Source Threshold Voltage CISS: Drain-Source Input Capacitance SOT-23 Name VDS ID RDS(ON) VGS(TH) CISS Order Number 2N7002E 60V 260mA 2.5 Ohm 2.5V @ 250uA 26.7pF @ 25V 2N7002ET1GOSTR-ND BSH103 30V 850mA 400 mOhm 400mV @ 1mA 83pF @ 24V BSH103,235-ND BSS138 60V 320mA 1.6 Ohm 1.5V @ 250uA 50pF @ 10V Mouser: 771-BSS138PW115 DMN2075U-7 20V 4.2A 38 mOhm 1V @ 250 uA 594.3pF @ 10V DMN2075U-7DICT-ND * BSS138 good choice for I2C level-shifting POWERPAK 1212-8 Name VDS ID RDS(ON) VGS(TH) CISS Order Number Si7308DN 60V 6A 58 mOhm 3V @ 250uA 665pF @ 15V SI7308DN-T1-E3CT-ND
R1-R33 = Arduino:RESISTORS: Resistors all kinds in 0603 and 0402
T1 = TC1-1T+:TC1-1T+: Surface Mount RF Transformer 50 0.4 to 500 MHz Source: Datasheet <https://www.minicircuits.com/pdfs/TC1-1T .pdf>; DESCRIPTION: Surface Mount RF Transformer 50 0.4 to 500 MHz; HEIGHT: 4.06mm; MANUFACTURER_NAME: Mini-Circuits; MANUFACTURER_PART_NUMBER: TC1-1T+; MOUSER_PART_NUMBER: 139-TC1-1T; MOUSER_PRICE-STOCK: https://www.mouser.co.uk/ProductDetail/Mini-Circuits/TC1-1T%2b?qs=xZ%2FP%252Ba9zWqaHZJWqyn8GiQ%3D%3D
TX = rf:MODULATOR_MICROBUILDER_SMACONNECTOR: SMA Connector 90° DIP SMA Connector, 50 Ohm (4UConnector: 07259)
USB = fifisdr:MINI-USB: Mini-USB-Buchse 5 pol mit Schirm
Y1 Y2 = microbuilder:CRYSTAL: Crystals HC49UP - Surface Mount Crystal 4.0MHz 18pF +/-30ppm Surface Mount Crystal [Digikey: 535-9857-1-ND] 12.0 MHz Surface Mount Crystal [Digikey: 535-9869-6-ND] 25.0 MHz Surface Mount Crystal [Digikey: 535-9078-1-ND] 2.5 x 2.0mm - MEMs SMT Crystal 16.0 MHz 10pF 20ppm 2.5 x 2.0mm Crystal [Digikey -40-85°C: 535-10923-1-ND] 3.2 x 2.5mm - MEMs SMT Crystal 12.0 MHz 8pF 15ppm 3.2 x 2.5mm Crystal [Digikey: -10-70°C: 644-1047-1-ND -40-125°C: 644-1128-1-ND] 40~85°C cheaper: 644-1173-6-ND 16.0 MHz 8pF 15ppm 3.2 x 2.5mm Crystal [Digikey: -10-70°C: 644-1049-1-ND -40-125°C: 644-1129-2-ND]-40~85°C cheaper: 644-1175-6-ND 16.0 MHz 10pF 10ppm 3.2 x 2.5mm Crystal [Digikey: 644-1100-1-ND] 27.12 MHz 18pF 30ppm 3.2 x 2.5mm Crystal [Digikey: 887-1424-1-ND] 27.12MHz 10pF 10ppm 3.2 x 2.5mm Crystal [Digikey: 887-1329-1-ND] 4.9 x 1.8mm - MEMs SMT Crystal 32.768 KHz 12.5pF 20ppm 4.9 x 1.8mm Crystal [Digikey: SE2415CT-ND] 8.0 x 3.8mm - Surface Mount Crystal 32.768kHz 12.5pF 20ppm -40°C-85°C [Digikey: 535-9166-2-ND] Cylinder 32.768KHz Cylinder Crystal (2x6mm body) [Ex. Digikey: 300-8341-2-ND]
Y3 = SparkFun:RESONATOR: Resonator Small SMD resonator. This is the itty bitty 10/20MHz resonators with built in caps. CSTCE10M0G55 and CSTCE20M0V53. Footprint has been reviewed closely but hasn't been tested yet.

## Net classes
0 default: width 0.3 mm
1 USB: width 0.406 mm